# Altium schematic sheet rtc.SchDoc
size A4; DocumentNumber: 4; SheetNumber: 4; SheetTotal: 5
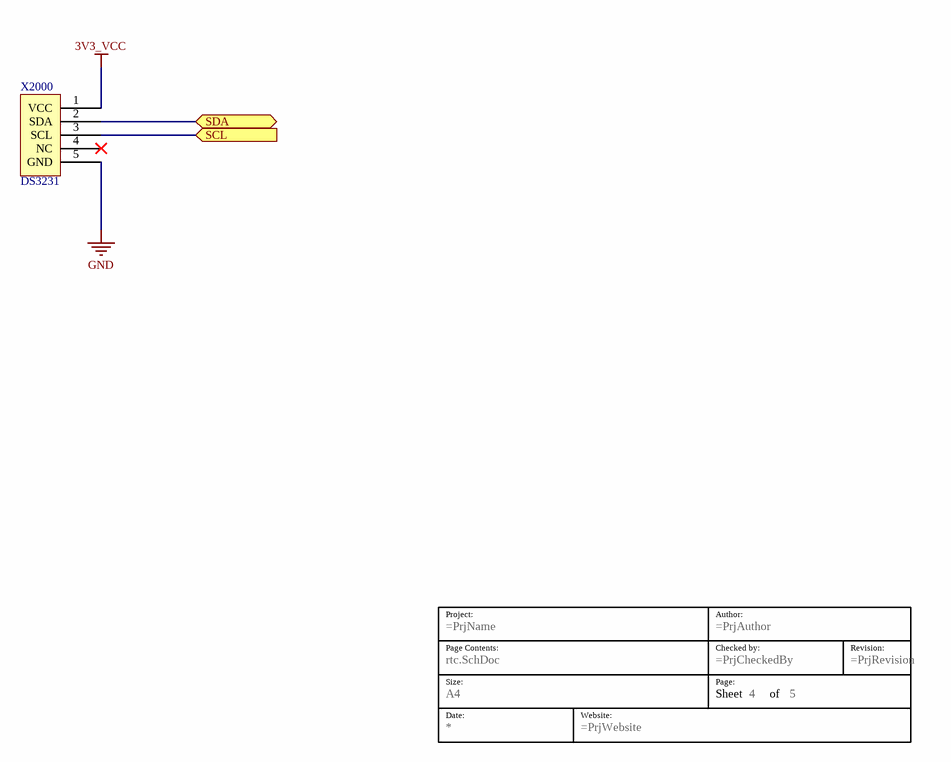
[diagram p0: rtc.SchDoc]

## Parts
*?  Size: A4  (hidden comment: TITLE BLOCK)  (graphical)
X2000  DS3231  [DS3231-MINI]

## Ports
SCL (in), SDA (bidir)

## Nets
3V3_VCC: X2000.1(VCC)
GND: X2000.5(GND)
SCL: X2000.3(SCL) ; port SCL
SDA: X2000.2(SDA) ; port SDA

Not connected (* = marked no-connect by the designer): X2000 4(NC)*

## Notes on the sheet
- (in symbol TITLE BLOCK) Project:; Author:; Page Contents:; Checked by:; Revision:; Size:; Page:; Sheet; of; Date:; Website:

## Library data of the parts
X2000 = DS3231-MINI-HEADER: DS3231 REAL TIME CLOCK